# EAGLE design kitt (EAGLE 7.6.0)
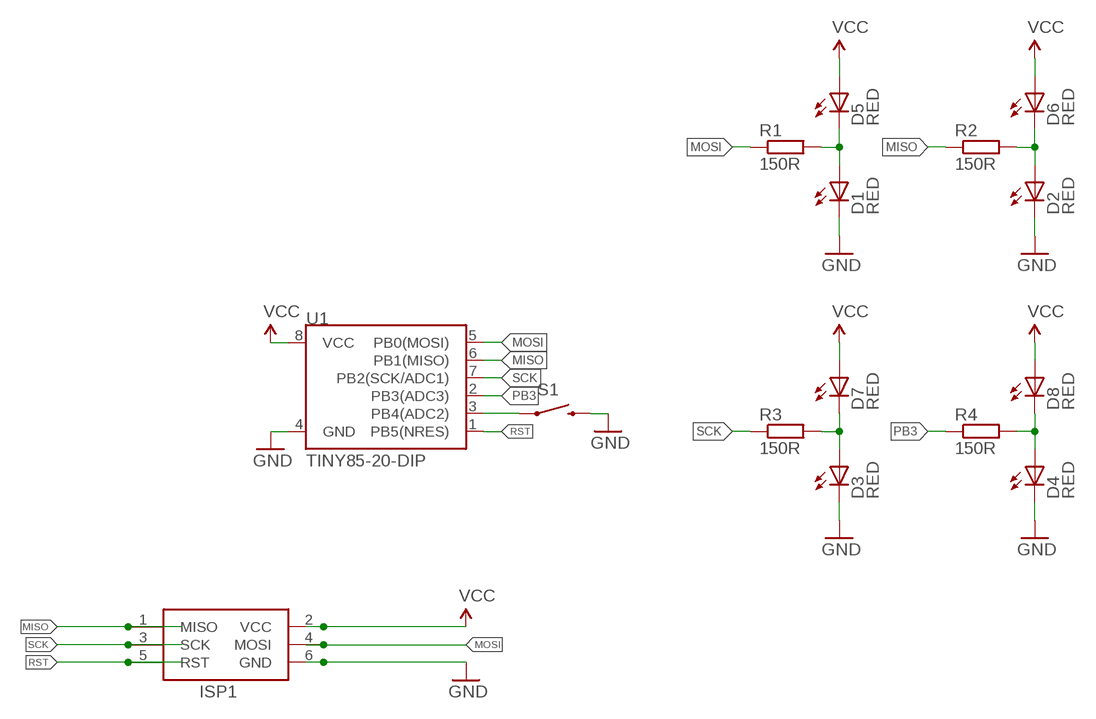
[diagram p0: schematic, sheet 1]

## Parts
D1  RED  LEDCHIP-LED0805  [CHIP-LED0805]
D2  RED  LEDCHIP-LED0805  [CHIP-LED0805]
D3  RED  LEDCHIP-LED0805  [CHIP-LED0805]
D4  RED  LEDCHIP-LED0805  [CHIP-LED0805]
D5  RED  LEDCHIP-LED0805  [CHIP-LED0805]
D6  RED  LEDCHIP-LED0805  [CHIP-LED0805]
D7  RED  LEDCHIP-LED0805  [CHIP-LED0805]
D8  RED  LEDCHIP-LED0805  [CHIP-LED0805]
ISP1  AVRISP-BOX  [AVRISP-BOX]
R1  150R  R-EU_M0805  [M0805]
R2  150R  R-EU_M0805  [M0805]
R3  150R  R-EU_M0805  [M0805]
R4  150R  R-EU_M0805  [M0805]
S1  SWITCH-MOMENTARY-2PTH  [TACTILE-PTH]
U1  TINY85-20-DIP  ATTINY45TINY85-20-DIP  [DIP08]

## Nets
GND: D1.C D2.C D3.C D4.C ISP1.6(GND) S1.3 U1.4(GND)
MISO: ISP1.1(MISO) R2.1 U1.6(PB1(MISO))
MOSI: ISP1.4(MOSI) R1.1 U1.5(PB0(MOSI))
N$1: S1.1 U1.3(PB4(ADC2))
N$2: D1.A D5.C R1.2
N$11: D2.A D6.C R2.2
N$13: D3.A D7.C R3.2
N$14: D4.A D8.C R4.2
PB3: R4.1 U1.2(PB3(ADC3))
RST: ISP1.5(RST) U1.1(PB5(NRES))
SCK: ISP1.3(SCK) R3.1 U1.7(PB2(SCK/ADC1))
VCC: D5.A D6.A D7.A D8.A ISP1.2(VCC) U1.8(VCC)

## Library data of the parts
D1-D8 = led:LED: LED OSRAM: - CHIPLED LG R971, LG N971, LY N971, LG Q971, LY Q971, LO R971, LY R971 LH N974, LH R974 LS Q976, LO Q976, LY Q976 LO Q996 - Hyper CHIPLED LW Q18S LB Q993, LB Q99A, LB R99A - SideLED LS A670, LO A670, LY A670, LG A670, LP A670 LB A673, LV A673, LT A673, LW A673 LH A674 LY A675 LS A676, LA A676, LO A676, LY A676, LW A676 LS A679, LY A679, LG A679 - Hyper Micro SIDELED® LS Y876, LA Y876, LO Y876, LY Y876 LT Y87S - SmartLED LW L88C, LW L88S LB L89C, LB L89S, LG L890 LS L89K, LO L89K, LY L89K LS L896, LA L896, LO L896, LY L896 - TOPLED LS T670, LO T670, LY T670, LG T670, LP T670 LSG T670, LSP T670, LSY T670, LOP T670, LYG T670 LG T671, LOG T671, LSG T671 LB T673, LV T673, LT T673, LW T673 LH T674 LS T676, LA T676, LO T676, LY T676, LB T676, LH T676, LSB T676, LW T676 LB T67C, LV T67C, LT T67C, LS T67K, LO T67K, LY T67K, LW E67C LS E67B, LA E67B, LO E67B, LY E67B, LB E67C, LV E67C, LT E67C LW T67C LS T679, LY T679, LG T679 LS T770, LO T770, LY T770, LG T770, LP T770 LB T773, LV T773, LT T773, LW T773 LH T774 LS E675, LA E675, LY E675, LS T675 LS T776, LA T776, LO T776, LY T776, LB T776 LHGB T686 LT T68C, LB T68C - Hyper Mini TOPLED® LB M676 - Mini TOPLED Santana® LG M470 LS M47K, LO M47K, LY M47K Source: http://www.osram.convergy.de LUXEON: - LUMILED® LXK2-PW12-R00, LXK2-PW12-S00, LXK2-PW14-U00, LXK2-PW14-V00 LXK2-PM12-R00, LXK2-PM12-S00, LXK2-PM14-U00 LXK2-PE12-Q00, LXK2-PE12-R00, LXK2-PE12-S00, LXK2-PE14-T00, LXK2-PE14-U00 LXK2-PB12-K00, LXK2-PB12-L00, LXK2-PB12-M00, LXK2-PB14-N00, LXK2-PB14-P00, LXK2-PB14-Q00 LXK2-PR12-L00, LXK2-PR12-M00, LXK2-PR14-Q00, LXK2-PR14-R00 LXK2-PD12-Q00, LXK2-PD12-R00, LXK2-PD12-S00 LXK2-PH12-R00, LXK2-PH12-S00 LXK2-PL12-P00, LXK2-PL12-Q00, LXK2-PL12-R00 Source: www.luxeon.com KINGBRIGHT: KA-3528ASYC Source: www.kingbright.com
ISP1 = adafruit:AVRISP: AVR ISP HEADER Standard 6 pin header for AVR programming
R1-R4 = rcl:R-EU_: RESISTOR, European symbol
S1 = SparkFun-Electromechanical:SWITCH-MOMENTARY-2: Various NO switches- pushbuttons, reed, etc
U1 = SparkFun-DigitalIC:ATTINY45: Atmel 8-pin 2/4/8kB flash uC; PROD_ID: IC-09445

## Board
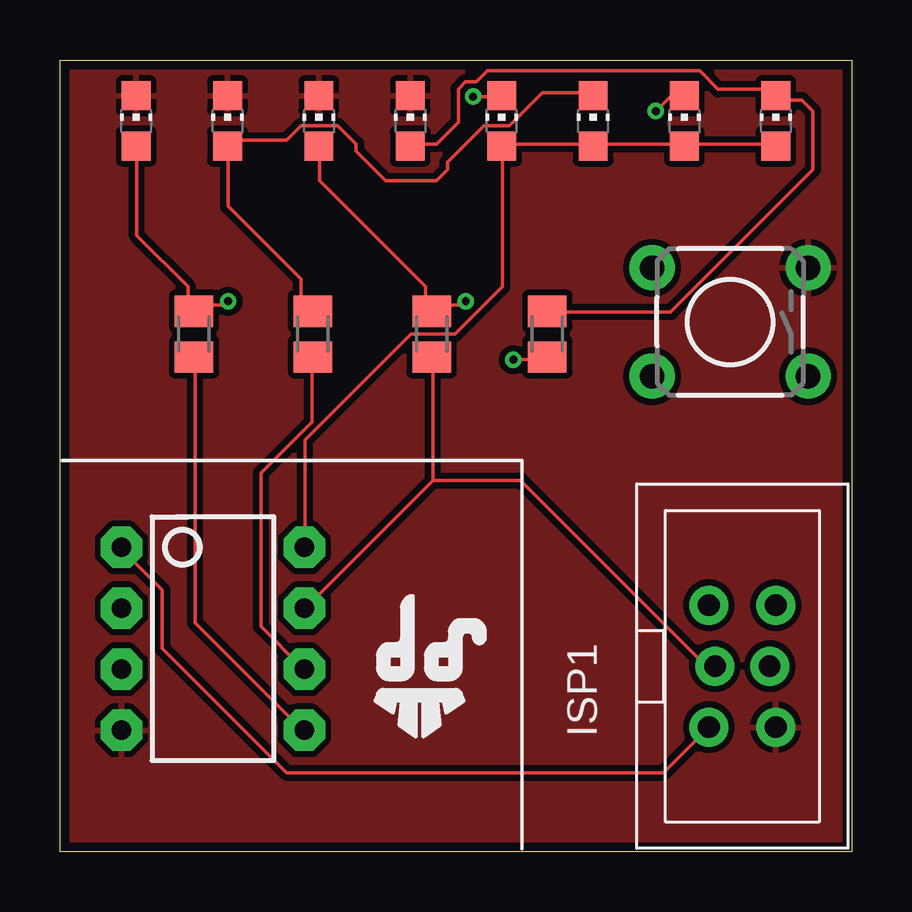
[diagram p1: board, top side]
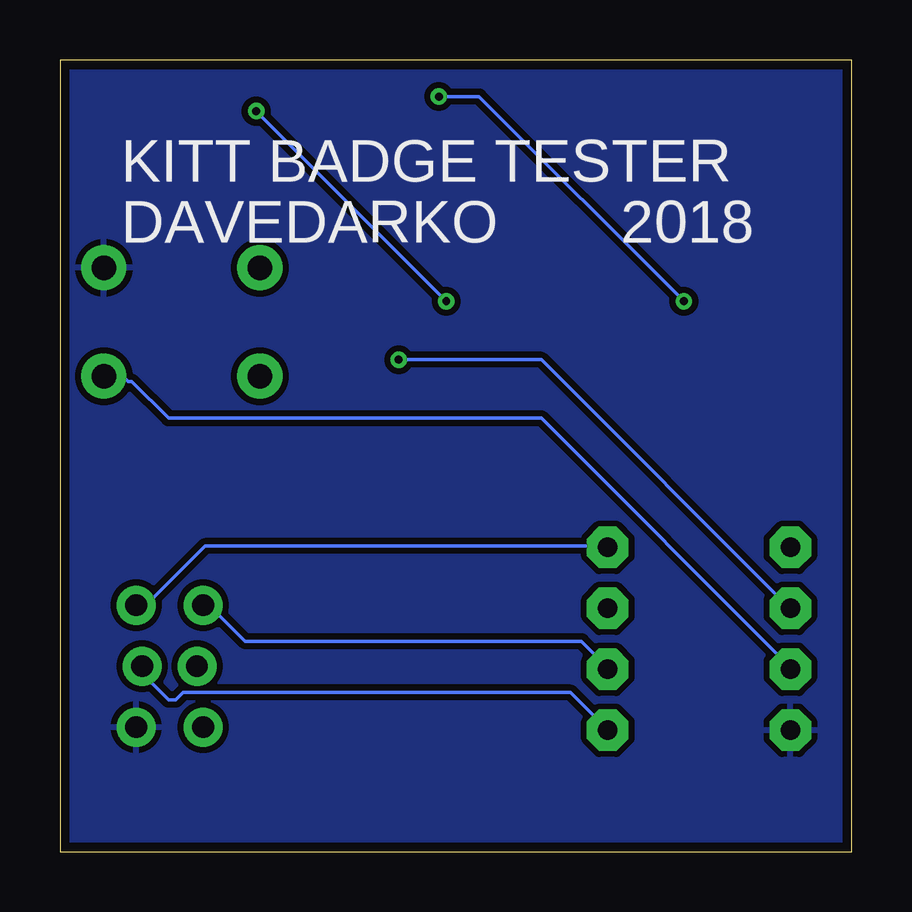
[diagram p2: board, bottom side, seen from below]

Size 33.02 x 33.02 mm. Coordinates in mm from the lower left corner, seen from the top.
Outline: 0,33.02 33.02,33.02 33.02,0 0,0 0,33.02
Copper layers (1*16): Top 0.0356mm / dielectric 1.5011mm / Bottom 0.0356mm
Design rules "LaenPCBOrder *": minimum track width 6mil, minimum drill 13mil, track to track 6mil, track to pad 6mil, pad to pad 6mil, via to via 6mil, smd to smd 6mil, copper to edge 15mil, drill to drill 6mil, minimum pad ring 7mil, minimum via ring 7mil, stop-mask expansion 3mil, vias tented up to drill 200mil, thermal gap 10mil

### Footprints (pad centres in the part's own frame; a part is rotated, then mirrored left to right if it is on the bottom)
CHIP-LED0805 = smd 1.2 x 1.2: A 0,-1.05; C 0,1.05
AVRISP-BOX = drill 0.9 pad 1.626: 1 -1.397,2.54; 2 1.397,2.54; 3 -1.143,0; 4 1.143,0; 5 -1.397,-2.54; 6 1.397,-2.54
M0805 = smd 1.3 x 1.6: 1 -0.95,0; 2 0.95,0
TACTILE-PTH = drill 1.016 pad 1.88: 1 -3.251,2.261; 2 3.251,2.261; 3 -3.251,-2.261; 4 3.251,-2.261
DIP08 = drill 0.813 pad 1.727 octagon: 1 -3.81,-3.81; 2 -1.27,-3.81; 3 1.27,-3.81; 4 3.81,-3.81; 5 3.81,3.81; 6 1.27,3.81; 7 -1.27,3.81; 8 -3.81,3.81

### Placement (x,y rotation side)
D1  3.17,30.48 0 top
D2  6.99,30.48 0 top
D3  10.79,30.48 0 top
D4  14.61,30.48 0 top
D5  18.41,30.48 0 top
D6  22.23,30.48 0 top
D7  26.04,30.48 0 top
D8  29.84,30.48 0 top
ISP1  28.45,7.75 0 top
R1  5.59,21.59 90 top
R2  10.54,21.59 90 top
R3  15.49,21.59 90 top
R4  20.32,21.59 90 top
S1  27.94,22.1 180 top
U1  6.38,8.89 270 top
U$3  [DAVEDARKO2_LOGO]  14.99,6.99 0 top

### Tracks (layer width: path | path; a pad name or v marks a point on that pad's centre or on a via)
GND
  pour Top (isolate 0.254): 35.56,35.56 0,35.56 0,0 35.56,0
  pour Bottom (isolate 0.254): -2.54,38.1 38.1,38.1 38.1,-2.54 -2.54,-2.54
MISO
  Top 0.152: R2.1 10.52,20.52 10.52,17.93 8.38,15.8 8.38,9.4 10.06,7.72 U1.6
  Bottom 0.152: ISP1.1 26.98,10.16 26.67,10.16 25.3,8.79 11.28,8.79 10.21,7.72 U1.6
MOSI
  Top 0.152: R1.1 5.64,20.52 5.64,9.55 10.06,5.13 U1.5
  Bottom 0.152: ISP1.4 29.57,7.72 29.57,7.42 28.5,6.35 28.19,6.35 27.89,6.66 11.73,6.66 10.21,5.13 U1.5
N$1
  Bottom 0.152: U1.3 2.59,7.72 12.95,18.09 28.5,18.09 30.02,19.61 30.18,19.61 30.33,19.76 31.09,19.76 S1.1
N$2  (via drill 0.33)
  Top 0.152: D1.A 3.2,29.36 3.2,25.7 5.33,23.57 5.33,22.81 5.49,22.66 R1.2 5.64,22.66 5.79,22.81 6.86,22.81 v7.01,22.96 | v17.22,31.5 18.29,31.5 D5.C
  Bottom 0.152: v17.22,31.5 15.54,31.5 v7.01,22.96
N$11
  Top 0.152: R2.2 10.52,22.66 10.06,23.11 10.06,23.88 7.01,26.92 7.01,29.36 D2.A 7.01,29.52 7.16,29.67 9.45,29.67 10.06,30.28 11.58,30.28 12.34,29.52 12.34,29.21 13.56,27.99 15.7,27.99 16.15,28.45 16.15,28.75 17.68,30.28 18.75,30.28 20.12,31.65 22.1,31.65 D6.C
N$13  (via drill 0.33)
  Top 0.152: D3.A 10.82,29.36 10.82,27.99 15.24,23.57 15.24,22.81 15.39,22.66 R3.2 15.54,22.66 15.7,22.81 16.76,22.81 v16.92,22.96 | v24.84,30.89 25.45,31.5 25.91,31.5 D7.C
  Bottom 0.152: v16.92,22.96 v24.84,30.89
N$14
  Top 0.152: D4.A 14.63,29.52 15.7,29.52 16.61,30.43 16.61,31.8 16.92,32.11 17.37,32.11 17.83,32.56 26.67,32.56 27.43,31.8 29.57,31.8 29.72,31.65 D8.C 29.87,31.5 30.02,31.34 30.94,31.34 31.39,30.89 31.39,28.45 25.45,22.5 20.42,22.5 R4.2
PB3  (via drill 0.33)
  Top 0.152: v18.9,20.52 20.27,20.52 R4.1
  Bottom 0.152: v18.9,20.52 12.95,20.52 2.59,10.16 U1.2
RST
  Top 0.152: ISP1.5 25.15,3.3 9.45,3.3 4.27,8.48 4.27,10.92 2.59,12.6 U1.1
SCK
  Top 0.152: 15.54,15.49 15.54,20.52 R3.1 | 15.54,15.49 10.21,10.16 U1.7 | 15.54,15.49 19.2,15.49 26.82,7.87 27.28,7.87 ISP1.3
VCC
  Top 0.152: D8.A 29.72,29.52 26.06,29.52 D7.A 25.91,29.52 22.25,29.52 D6.A 22.1,29.52 18.44,29.52 D5.A 18.44,29.36 18.44,23.57 16.46,21.59 14.63,21.59 10.21,17.17 10.21,12.75 U1.8
  Bottom 0.152: ISP1.2 29.72,10.31 29.41,10.31 26.98,12.75 10.21,12.75 U1.8

### Text on the board
bNames: KITT BADGE TESTER | 2018 | DAVEDARKO